# Altium schematic sheet ESP8266_ESP12.SchDoc
size A4; SheetNumber: 2; SheetTotal: 3
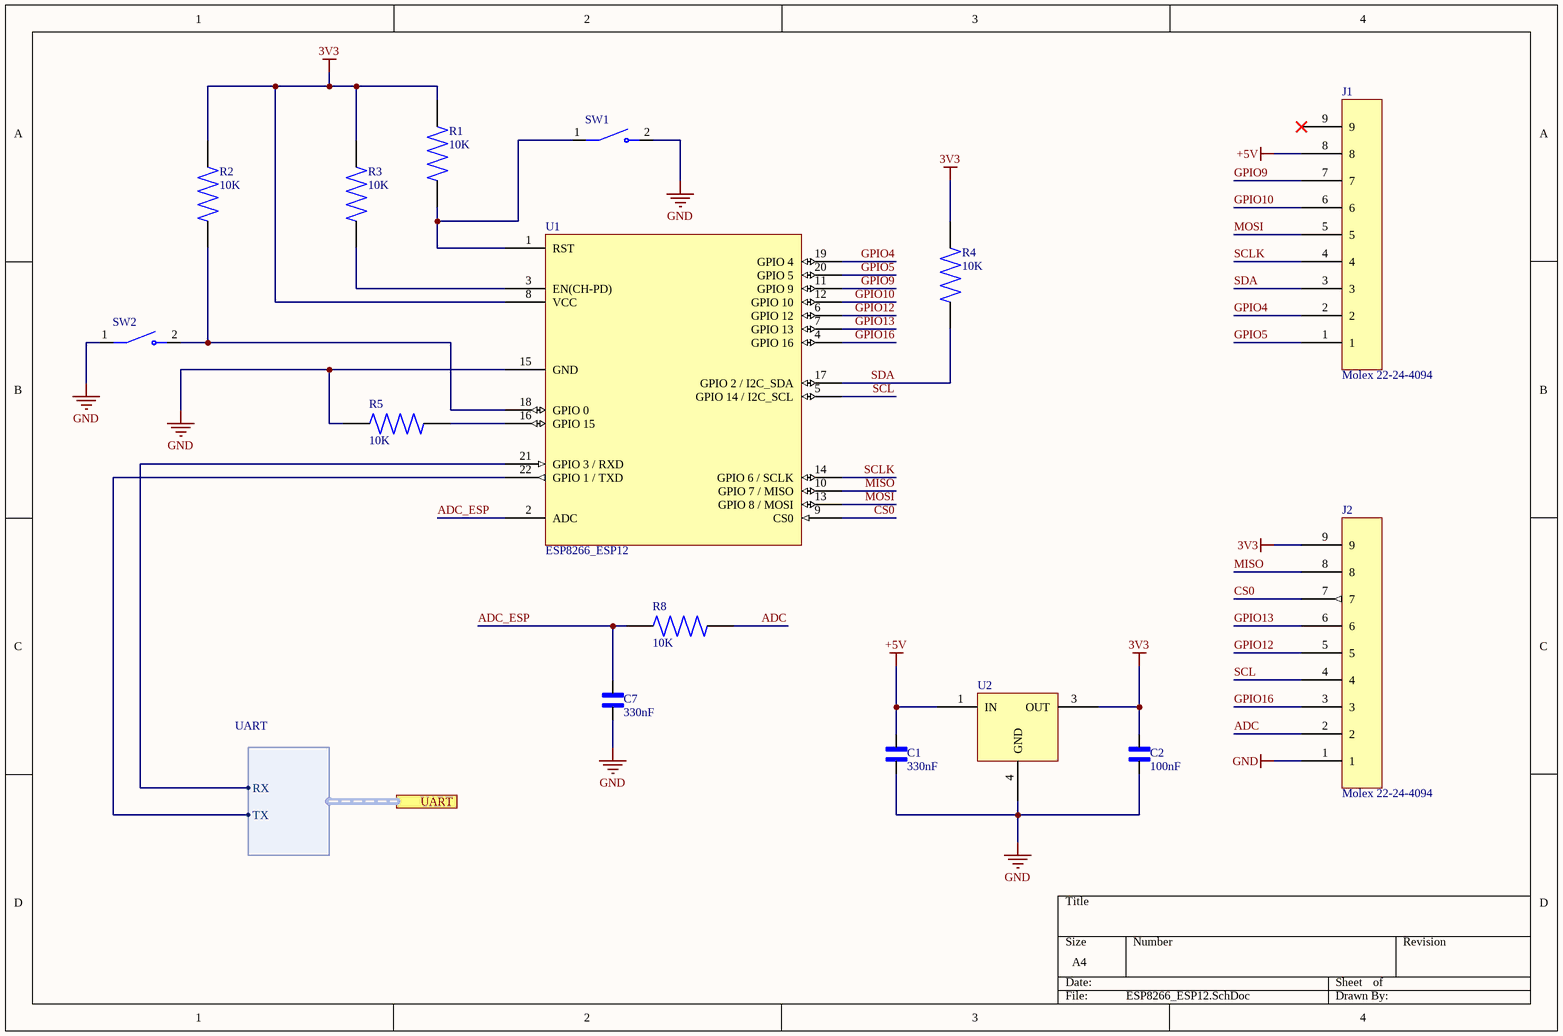
[diagram p0: ESP8266_ESP12.SchDoc]

## Parts
C1  330nF  [CAPC1608X90N]
C2  100nF  [CAPC1608X90N]
C7  330nF  [CAPC1608X90N]
J1  Molex 22-24-4094  [Molex 22-28-4094]
J2  Molex 22-24-4094  [Molex 22-28-4094]
R1  10K  [RESC1508X50N]
R2  10K  [RESC1508X50N]
R3  10K  [RESC1508X50N]
R4  10K  [RESC1508X50N]
R5  10K  [RESC1508X50N]
R8  10K  [RESC1508X50N]
SW1  B3U-1000P  [SW_B3U-1000P]  (value not drawn)
SW2  B3U-1000P  [SW_B3U-1000P]  (value not drawn)
U1  ESP8266_ESP12  [ESP8266-ESP12]
U2  UA78M33CDCY  [UA78M33CDCY]  (value not drawn)

## Ports
UART (harness UART, see WiFiBoard[2B], FT232RL[4A])

## Harnesses
UART: RX, TX

## Nets
3V3: C2.2 J2.9 R1.2 R2.2 R3.2 R4.2 U1.8(VCC) U2.3(OUT)
+5V: C1.2 J1.8 U2.1(IN)
GND: C1.1 C2.1 C7.1 J2.1 R5.1 SW1.2 SW2.1 U1.15(GND) U2.4(GND)
ADC: J2.2 R8.2
ADC_ESP: C7.2 R8.1 U1.2(ADC)
CS0: J2.7 U1.9(CS0)
GPIO4: J1.2 U1.19(GPIO_4)
GPIO5: J1.1 U1.20(GPIO_5)
GPIO9: J1.7 U1.11(GPIO_9)
GPIO10: J1.6 U1.12(GPIO_10)
GPIO12: J2.5 U1.6(GPIO_12)
GPIO13: J2.6 U1.7(GPIO_13)
GPIO16: J2.3 U1.4(GPIO_16)
MISO: J2.8 U1.10(GPIO_7_/_MISO)
MOSI: J1.5 U1.13(GPIO_8_/_MOSI)
SCL: J2.4 U1.5(GPIO_14_/_I2C_SCL)
SCLK: J1.4 U1.14(GPIO_6_/_SCLK)
SDA: J1.3 R4.1 U1.17(GPIO_2_/_I2C_SDA)
NetR1_1: R1.1 SW1.1 U1.1(RST)
NetR2_1: R2.1 SW2.2 U1.18(GPIO_0)
NetR3_1: R3.1 U1.3(EN(CH-PD))
NetR5_2: R5.2 U1.16(GPIO_15)
NetU1_21: U1.21(GPIO_3_/_RXD) ; port UART.RX

Not connected (* = marked no-connect by the designer): J1 9*; U1 22(GPIO_1_/_TXD)

## Library data of the parts
C1 C2 C7 = GRM188R71C104KA01D: MF: {'manufacturer': u'Murata'}; Package: None; Price: None; Value: *; MP: GRM188R71C104KA01D; Availability: Unavailable
J1 J2 = Molex
R1-R5 R8 = CRCW06032K20FKEA: MF: {'manufacturer': u'Vishay Dale'}; Package: None; Price: None; Value: *; MP: CRCW06032K20FKEA; Availability: Unavailable
SW1 SW2 = B3U-1000P: Switch Tactile N.O. SPST Round Button Gull Wing 0.05A 12VDC 1.5N SMD Embossed T/R; Price: None; MP: B3U-1000P; Availability: Unavailable; Value: *; Package: None
U2 = UA78M33CDCY: TI (Texas Instruments) UA78M33CDCY